# EAGLE design PowerMosfetGSVINRailV1 (EAGLE 9.6.2)
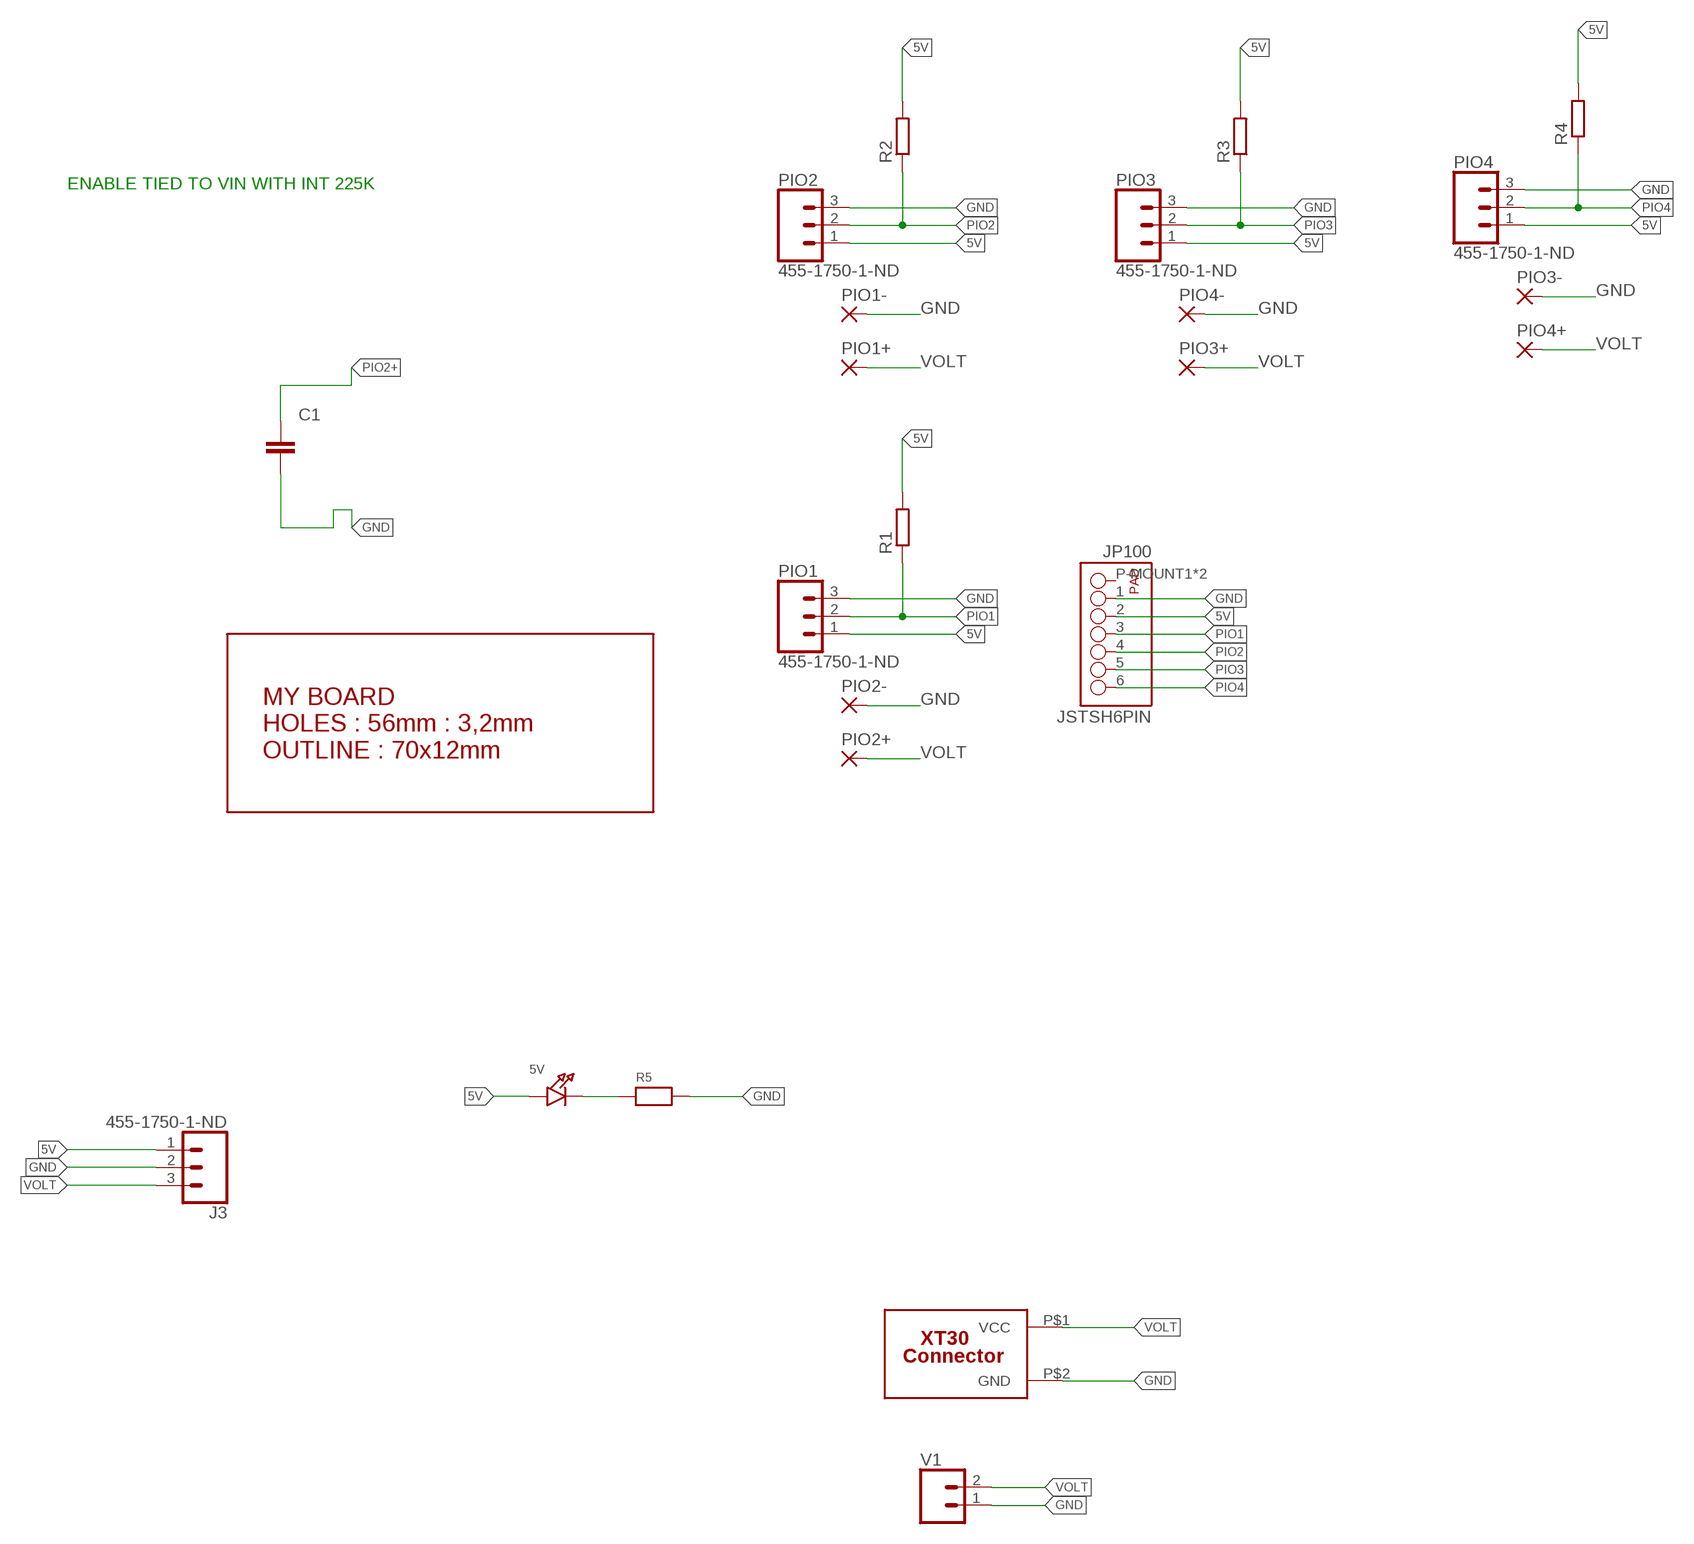
[diagram p0: schematic, sheet 1]

## Parts
5V  LED0805  [CHIPLED_0805]
C1  CAPACITOR_NPOL-0805  [C805]
J3  455-1750-1-ND  CONN_03  [1X03]
JP100  JSTSH6PIN  [SM06B-SRSS-TB]
PIO1  455-1750-1-ND  CONN_03  [1X03]
PIO1+  3,17/1,3  [3,17/1,3]
PIO1-  3,17/1,3  [3,17/1,3]
PIO2  455-1750-1-ND  CONN_03  [1X03]
PIO2+  3,17/1,3  [3,17/1,3]
PIO2-  3,17/1,3  [3,17/1,3]
PIO3  455-1750-1-ND  CONN_03  [1X03]
PIO3+  3,17/1,3  [3,17/1,3]
PIO3-  3,17/1,3  [3,17/1,3]
PIO4  455-1750-1-ND  CONN_03  [1X03]
PIO4+  3,17/1,3  [3,17/1,3]
PIO4-  3,17/1,3  [3,17/1,3]
R1  RESISTORR805-0805  [R805]
R2  RESISTORR805-0805  [R805]
R3  RESISTORR805-0805  [R805]
R4  RESISTORR805-0805  [R805]
R5  RESISTOR0805  [0805]
U$2  BOARD70X12HOES  [BOARD70X12]
U$6  XT30  [XT30-VERT]
V1  CONN_023.5MM  [SCREWTERMINAL-3.5MM-2]

## Nets
5V: 5V.A J3.1 JP100.2 PIO1.1 PIO2.1 PIO3.1 PIO4.1 R1.2 R2.2 R3.2 R4.2
GND: C1.2 J3.2 JP100.1 PIO1-.1(P) PIO1.3 PIO2-.1(P) PIO2.3 PIO3-.1(P) PIO3.3 PIO4-.1(P) PIO4.3 R5.2 U$6.P$2(GND) V1.1
N$3: 5V.C R5.1
PIO1: JP100.3 PIO1.2 R1.1
PIO2: JP100.4 PIO2.2 R2.1
PIO2+: C1.1
PIO3: JP100.5 PIO3.2 R3.1
PIO4: JP100.6 PIO4.2 R4.1
VOLT: J3.3 PIO1+.1(P) PIO2+.1(P) PIO3+.1(P) PIO4+.1(P) U$6.P$1(VCC) V1.2
Unconnected: JP100.P-MOUNT1 JP100.P-MOUNT2

## Notes on the sheet
- ENABLE TIED TO VIN WITH INT 225K

## Library data of the parts
5V = microbuilder:LED: LED 0603 - 0603 Surface Mount Package 2mA: Green LED - Low Power (3.9mcd, 2ma, 1.7Vf) - Digikey: 475-2709-2-ND Orange LED - Low Power (9.8mcd, 2ma, 1.8Vf) - Digikey: 475-1194-2-ND Red LED - Low Power (5mcd, 2ma, 1.8Vf) - Digikey: 475-1195-2-ND Yellow LED - Low Power (7mcd, 2ma, 1.8Vf) - Digikey: 475-1196-2-ND 5mA: Blue LED - Low Power (17mcd, 5ma, 2.9Vf) - Digikey: LNJ937W8CRACT-ND 0805 - 0805 Surface Mount Package 2mA: Red LED (8.8mcd, 2mA, 1.8Vf, Clear) - Low Power [Digikey: 475-2510-1-ND] Green LED (5mcd, 2mA, 1.8Vf, Clear) - Low Power [Digikey: 475-2730-1-ND] Yellow LED (11.3mcd, 2mA, 1.8Vf, Clear) - Low Power [Digikey: 475-2555-1-ND] 20mA: Red LED (104mcd, 20mA, Diffused) - LS R976 [Digikey: 475-1278-6-ND] Red LED (12mcd, 20mA, 2.0Vf, Clear) - APT2012EC [Digikey: 754-1128-1-ND] Green LED (15mcd, 20mA, 2.2Vf, Clear) - APT2012GC [Digikey: 754-1131-1-ND] Orange LED (160mcd, 20mA, 2.1Vf, Clear) - APT2012SECK [Digikey: 754-1130-1-ND] 1206 - 1206 Surface Mount Package Green LED (26mcd, 20mA, Diffused) - LG N971 [Digikey: 475-1407-6-ND] Red LED (15mcd, 20mA, Diffused) - LH N974 [Digikey: 475-1416-6-ND]
C1 = dp_devices:CAPACITOR_NPOL: Non-Polarized capacitor in various packages
J3 PIO1-PIO4 = SparkFun-Connectors:CONN_03: Multi connection point. Often used as Generic Header-pin footprint for 0.1 inch spaced/style header connections On any of the 0.1 inch spaced packages, you can populate with these: Break Away Headers - Straight <https://www.sparkfun.com/products/116> (PRT-00116) Break Away Male Headers - Right Angle <https://www.sparkfun.com/products/553> (PRT-00553) Female Headers <https://www.sparkfun.com/products/115> (PRT-00115) Break Away Headers - Machine Pin <https://www.sparkfun.com/products/117> (PRT-00117) Break Away Female Headers - Swiss Machine Pin <https://www.sparkfun.com/products/743> (PRT-00743) Stackable Header - 3 Pin (Female, 0.1") <https://www.sparkfun.com/products/13875> (PRT-13875) For SCREWTERMINALS and SPRING TERMINALS visit here: Screw Terimnals on SparkFun.com <https://www.sparkfun.com/search/results?term=Screw+Terminals> (5mm/3.5mm/2.54mm spacing) This device is also useful as a general connection point to wire up your design to another part of your project. Our various solder wires solder well into these plated through hole pads. Hook-Up Wire - Assortment (Stranded, 22 AWG) <https://www.sparkfun.com/products/11375> (PRT-11375) Hook-Up Wire - Assortment (Solid Core, 22 AWG) <https://www.sparkfun.com/products/11367> (PRT-11367) View the entire wire category on our website here <https://www.sparkfun.com/categories/141> Special notes: Molex polarized connector foot print use with SKU : PRT-08232 with associated crimp pins and housings.; PROD_ID: XXX-00000
JP100 = con-jst-shMax:JSTSH6PIN
PIO1+ PIO1- PIO2+ PIO2- PIO3+ PIO3- PIO4+ PIO4- = wirepad:3,17/1,3: THROUGH-HOLE PAD
R1-R4 = dp_devices:RESISTOR
R5 = microbuilder:RESISTOR: Resistors 0402 - 0402 Surface Mount Package 22 Ohm 1% 1/16W [Digikey: 311-22.0LRTR-ND] 33 Ohm 5% 1/16W 1.0K 5% 1/16W 1.5K 5% 1/16W 2.0K 1% 1/16W 10.0K 1% 1/16W [Digikey: 311-10.0KLRTR-ND] 10.0K 5% 1/16W [Digikey: RMCF0402JT10K0TR-ND] 12.1K 1% 1/16W [Digikey: 311-22.0LRTR-ND] 100.0K 5% 1/16W 0603 - 0603 Surface Mount Package 0 Ohm 1/10 Watt 1% Resistor 15 Ohm 1/10 Watt 1% Resistor 33 Ohm 1/10 Watt 1% Resistor 49.9 Ohm 1/10 Watt 1% Resistor 100 Ohm 1/10 Watt 1% Resistor 150 Ohm 1/10 Watt 1% Resistor 240 Ohm 1/10 Watt 1% Resistor 390 Ohm 1/10 Watt 1% Resistor 560 Ohm 1/10 Watt 1% Resistor 680 Ohm 1/10 Watt 1% Resistor 750 Ohm 1/10 Watt 1% Resistor 1.0K Ohm 1/10 Watt 1% Resistor 1.5K Ohm 1/10 Watt 1% Resistor 2.0K Ohm 1/10 Watt 1% Resistor 2.2K Ohm 1/10 Watt 1% Resistor 3.3K Ohm 1/10 Watt 1% Resistor 4.7K Ohm 1/10 Watt 1% Resistor 10.0K Ohm 1/10 Watt 1% Resistor 12.0K Ohm 1/10 Watt 1% Resistor 12.1K Ohm 1/10 Watt 1% Resistor 20.0K Ohm 1/10 Watt 1% Resistor 33.0K Ohm 1/10 Watt 1% Resistor 100.0K Ohm 1/10 Watt 1% Resistor 0805 - 0805 Surface Mount Package 0 Ohm 1/8 Watt 1% Resistor 33 Ohm 1/8 Watt 1% Resistor 100 Ohm 1/8 Watt 1% Resistor 150 Ohm 1/8 Watt 1% Resistor 200 Ohm 1/8 Watt 1% Resistor 240 Ohm 1/8 Watt 1% Resistor 330 Ohm 1/8 Watt 1% Resistor 390 Ohm 1/8 Watt 1% Resistor 470 Ohm 1/8 Watt 1% Resistor 1.0K Ohm 1/8 Watt 1% Resistor 1.5K Ohm 1/8 Watt 1% Resistor 2.0K Ohm 1/8 Watt 1% Resistor 4.7K Ohm 1/8 Watt 1% Resistor 5.1K Ohm 1/8 Watt 1% Resistor 5.6K Ohm 1/8 Watt 1% Resistor 10.0K Ohm 1/8 Watt 1% Resistor 22.0K Ohm 1/8 Watt 1% Resistor 33.0K Ohm 1/8 Watt 1% Resistor 100K Ohm 1/8 Watt 1% Resistor 1206 - 1206 Surface Mount Package 2012 - 2010 Surface Mount Package 0.11 Ohm 1/2 Watt 1% Resistor - Digikey: RHM.11UCT-ND
U$2 = MyBreadBoards:BOARD70X12HOES
U$6 = MyBreadBoards:XT30
V1 = SparkFun-Connectors:CONN_02: Multi connection point. Often used as Generic Header-pin footprint for 0.1 inch spaced/style header connections On any of the 0.1 inch spaced packages, you can populate with these: Break Away Headers - Straight <https://www.sparkfun.com/products/116> (PRT-00116) Break Away Male Headers - Right Angle <https://www.sparkfun.com/products/553> (PRT-00553) Female Headers <https://www.sparkfun.com/products/115> (PRT-00115) Break Away Headers - Machine Pin <https://www.sparkfun.com/products/117> (PRT-00117) Break Away Female Headers - Swiss Machine Pin <https://www.sparkfun.com/products/743> (PRT-00743) For SCREWTERMINALS and SPRING TERMINALS visit here: Screw Terimnals on SparkFun.com <https://www.sparkfun.com/search/results?term=Screw+Terminals> (5mm/3.5mm/2.54mm spacing) This device is also useful as a general connection point to wire up your design to another part of your project. Our various solder wires solder well into these plated through hole pads. Hook-Up Wire - Assortment (Stranded, 22 AWG) <https://www.sparkfun.com/products/11375> (PRT-11375) Hook-Up Wire - Assortment (Solid Core, 22 AWG) <https://www.sparkfun.com/products/11367> (PRT-11367) View the entire wire category on our website here <https://www.sparkfun.com/categories/141> Special notes: Molex polarized connector foot print use with: PRT-08233 with associated crimp pins and housings. 2.54_SCREWTERM for use with PRT-10571. 3.5mm Screw Terminal footprints for PRT-08084 5mm Screw Terminal footprints for use with PRT-08432; PROD_ID: CONN-08399

## Board
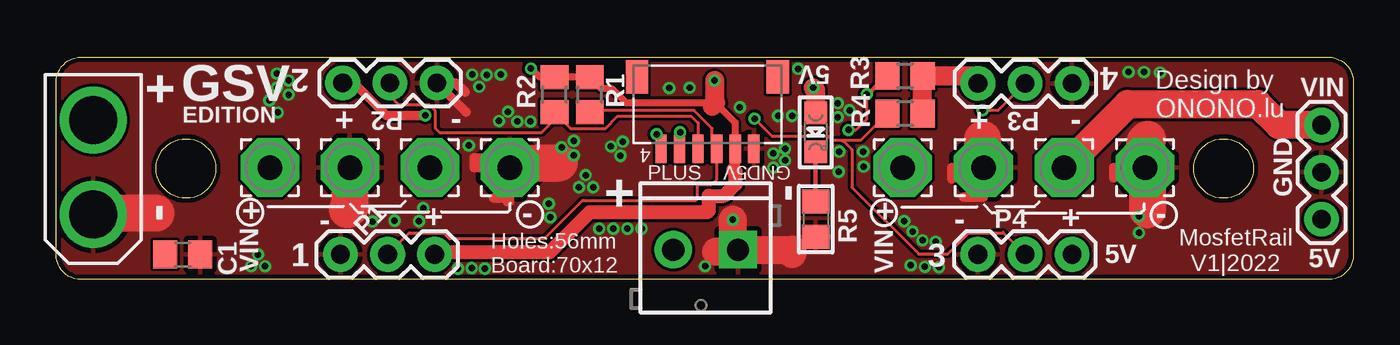
[diagram p1: board, top side]
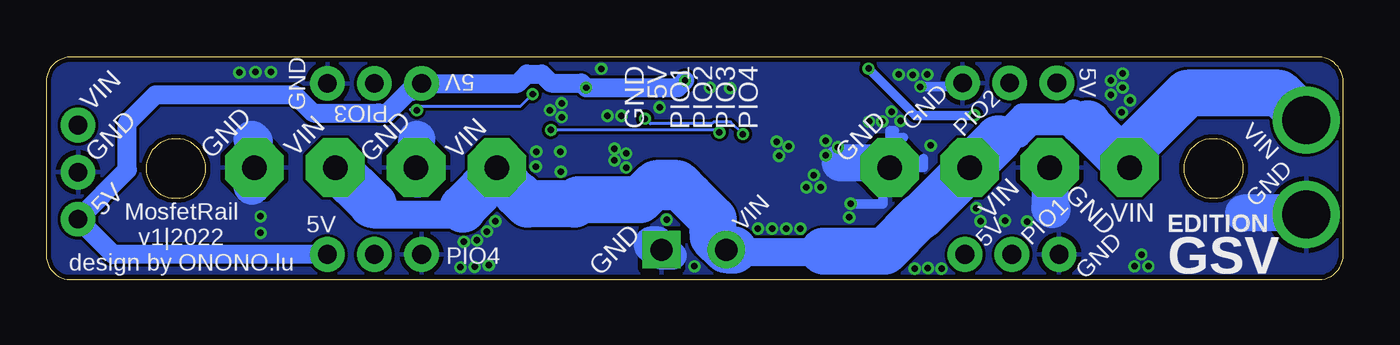
[diagram p2: board, bottom side, seen from below]

Size 70 x 12 mm. Coordinates in mm from the lower left corner, seen from the top.
Copper layers (1*16): Top 0.035mm / dielectric 1.5mm / Bottom 0.035mm
Design rules "dirt_cheap_dirty_boards.v1.1": minimum track width 6mil, minimum drill 12mil, track to track 6mil, track to pad 6mil, pad to pad 6mil, via to via 6mil, smd to smd 0mil, copper to edge 10mil, drill to drill 10mil, minimum pad ring 10mil, minimum via ring 6mil, stop-mask expansion 2mil, vias tented up to drill 25mil, thermal gap 10mil

### Footprints (pad centres in the part's own frame; a part is rotated, then mirrored left to right if it is on the bottom)
CHIPLED_0805 = smd 1.2 x 1.2: A 0,-1.05; C 0,1.05
C805 = smd 1.3 x 1.5: 1 -0.95,0; 2 0.95,0
1X03 = drill 1.016 pad 1.88: 1 0,0; 2 2.54,0; 3 5.08,0
SM06B-SRSS-TB = smd 0.6 x 1.55: 1 -7.58,4.445; 2 -6.58,4.445; 3 -5.58,4.445; 4 -4.58,4.445; 5 -3.58,4.445; 6 -2.58,4.445 | smd 1.2 x 1.8: P-MOUNT1 -8.88,0.57; P-MOUNT2 -1.28,0.57
3,17/1,3 = drill 1.321 pad 3.175 octagon: 1 0,0
R805 = smd 1.3 x 1.5: 1 -0.95,0; 2 0.95,0
0805 = smd 1.3 x 1.5: 1 -0.95,0; 2 0.95,0
XT30-VERT = drill 2.6: P$1 0.127,7.771; P$2 0.127,2.667
SCREWTERMINAL-3.5MM-2 = drill 1.2 pad 2.032 square: 1 0,0 | drill 1.2 pad 2.032: 2 3.5,0

### Placement (x,y rotation side)
5V  40.98,7.95 180 top
C1  6.82,1.35 0 top
J3  68.29,3.26 90 top
JP100  30.06,11.51 180 top
PIO1  20.41,1.35 180 top
PIO1+  11.52,6.05 90 top
PIO1-  15.84,6.05 90 top
PIO2  15.46,10.62 0 top
PIO2+  20.16,6.05 90 top
PIO2-  24.47,6.05 90 top
PIO3  49.75,10.6 0 top
PIO3+  45.68,6.05 90 top
PIO3-  50.04,6.05 90 top
PIO4  54.83,1.35 180 top
PIO4+  54.4,6.05 90 top
PIO4-  58.76,6.05 90 top
R1  28.79,9.99 90 top
R2  26.89,9.99 90 top
R3  45.81,11 0 top
R4  45.81,8.97 0 top
R5  40.98,3.26 270 top
U$2  69.94,-0.05 90 top
U$6  1.87,0.84 0 top
V1  36.79,1.6 180 top

### Tracks (layer width: path | path; a pad name or v marks a point on that pad's centre or on a via)
5V  (via drill 0.35)
  Top 0.152: 27.52,10.94 R2.2
  Top 0.381: JP100.2 36.64,8.49 35.78,9.35 35.4,9.35 | 27.52,10.94 R1.2 29.39,10.33 29.96,10.33 30.74,9.56 35.6,9.56 | R2.2 26.07,10.94 v25.62,11.39
  Top 0.508: 36.67,5.8 36.67,7.04 JP100.2 | v19.9,8.87 17.82,8.87 16.07,10.62 PIO2.1
  Top 0.762: 36.54,5.92 36.67,5.8 36.67,5.16 36.03,4.53 35.22,4.53 35.22,3.71 35.14,3.64 28.79,3.64 26.63,1.48 20.54,1.48 PIO1.1
  Top 1.016: R4.2 R3.2 49.34,11 PIO3.1 | v40.86,10.37 40.98,10.24 5V.A | v35.52,10.75 35.52,9.48 | 35.52,9.48 35.4,9.35 | 35.6,9.56 35.52,9.48
  Bottom 0.508: v25.62,11.39 23.09,8.87 v19.9,8.87 | 16.09,10.62 PIO2.1
  Bottom 1.016: PIO4.1 66.38,1.35 J3.1 65.62,5.92 65.62,8.46 64.1,9.99 56.58,9.99 55.59,9 52.08,9 | 52.03,8.97 52.06,9 52.08,9 | v35.52,10.75 35.9,10.37 v40.86,10.37 41.11,10.62 42.76,10.62 43.24,11.1 44.06,11.1 44.57,10.6 PIO3.1 50.15,10.19 50.41,10.19 51.6,9 52.08,9
GND  (via drill 0.35)
  Top 0.508: 22.12,9.04 PIO2.3 21.55,10.62 22.06,10.11 | PIO2-.1 22.54,6.05 22.54,6.56 23.79,6.56 | PIO2-.1 24.47,4.22 24.32,4.22 | PIO2-.1 24.47,4.4 23.59,4.4 | 48.96,4.45 50.04,4.45 PIO3-.1 48.35,6.05 48.35,5.44 | PIO4-.1 57.09,6.05 57.09,5.49
  Top 1.524: V1.1 39.71,1.6 39.71,1.38 | V1.1 36.79,1.5 35.63,1.5 | V1.1 36.51,1.6 v36.51,3.23
  Top 2: U$6.P$2 2.07,3.59 5.38,3.59 | PIO1-.1 15.84,3.89 15.71,3.76 | PIO2-.1 24.73,6.3 27.14,6.3 | PIO3-.1 50,6.09 50,7.57 | 58.89,3.76 58.89,5.92 PIO4-.1 58.76,7.44 58.89,7.56
  Bottom 0.508: PIO2.3 20.74,10.42 v22.82,10.42 | v26.58,4.09 24.83,4.09 24.83,5.59 | PIO2-.1 22.65,6.05 22.65,6.53 | PIO2-.1 24.47,8.06 24.22,8.06 | PIO2-.1 24.47,7.68 23.74,7.68
  Bottom 1.524: V1.1 36.79,1.3 36.18,1.3
  Bottom 2: U$6.P$2 2.07,3.59 5.38,3.59 | PIO1-.1 15.84,3.89 15.71,3.76 | PIO2-.1 24.73,6.3 27.14,6.3 | 50,7.57 50,6.09 PIO3-.1 50.04,5.54 49.93,5.42 | 58.89,7.57 58.76,7.45 PIO4-.1 58.89,5.92 58.89,5.03 | V1.1 37.07,1.88 37.3,1.88
  other vias: 30.06,2.75 29.3,2.75 30.82,2.75 31.59,2.75 28.21,4.98 28.97,4.98 28.56,5.64 30.44,6.68 29.94,7.19 30.57,7.45 35.02,0.72 38.7,6.05 38.7,6.81 39.33,6.43 39.33,7.07 38.95,8.84 39.71,8.84 33.09,10.34 34.18,10.37 22.42,0.61 21.68,0.59 12.54,9.99 12.54,10.75 11.5,9.68 11.9,10.37 11.95,9.02 11.9,11.13 10.5,0.72 11.27,0.72 10.89,1.35 22.44,11.08 23.23,11.05 27.93,7.5 27.93,6.71 27.27,7.14 42.23,5.82 43.55,6.91 42.25,6.91 42.18,8.77 42.18,9.53 42.81,9.15 47.46,2.04 46.12,0.77 46.88,0.69 47.64,0.66 57.88,11.21 58.71,11.21 59.58,11.18 23.89,8.56 24.88,8.54 24.37,9.07 25.59,8.54 23.99,11.08 43.58,6.1 45.76,3.15 58.43,2.52 58.43,3.41 46.22,2.59 46.75,2.11 23.13,0.59 22.27,7.24 18.25,3.18 19.57,3.15 17.06,3.13 19.8,3.86 36.9,9.3 40.05,11.38 26.66,3.36
  pour Top: -1.69,12.93 -1.69,-1.65 69.48,-1.65 70.86,-0.28 70.86,12.93
  pour Bottom: -1.69,12.93 -1.69,-1.8 69.52,-1.8 70.85,-0.46 70.85,12.93
N$3
  Top 0.254: R5.1 5V.C
PIO1
  Top 0.152: R1.1 28.89,9.14 34.43,9.14 35.4,8.16 35.4,7.31 JP100.3 35.65,5.41 35.37,5.14 34.61,5.14 34.61,4.37 34.51,4.27 28.41,4.27 26.35,2.21 21.2,2.21 20.89,2.52 19.04,2.52 PIO1.2
PIO2
  Top 0.152: JP100.4 34.63,8.46 34.27,8.82 30.3,8.82 29.64,8.16 27.77,8.16 R2.1 26.89,8.64 26.18,7.93 20.69,7.93 20.46,8.16 20.46,9.1 20.13,9.42 18.51,9.42 18,9.94 PIO2.2 18.1,10.62
PIO3  (via drill 0.35)
  Top 0.152: JP100.5 33.64,7.93 v33.67,7.95 | 44.7,10.97 v43.75,10.02 | v42.76,8.08 43.16,8.08 43.75,8.67 v43.75,10.02 | v43.75,10.02 44.73,11 | R3.1 43.87,10.02 v43.75,10.02 | v50,9.15 50.84,9.15 PIO3.2
  Bottom 0.152: v33.67,7.95 33.8,8.08 v42.76,8.08 | 43.65,10.11 v43.75,10.02 44.41,9.35 50.18,9.35 50.34,9.19 50.31,9.15 v50,9.15
PIO4  (via drill 0.35)
  Top 0.152: 42.38,7.53 41.89,7.53 41.68,7.73 38.64,7.73 v37.68,8.69 | 42.38,7.53 43.42,7.53 R4.1 | v32.4,7.85 32.66,7.59 32.64,7.57 JP100.6 | 42.38,7.53 42.44,7.47 42.48,7.47 42.94,7.01 42.94,4.98 46.55,1.38 48.12,1.38 48.58,1.83 49.26,2.52 51.07,2.52 51.09,2.54 PIO4.2
  Bottom 0.152: v32.4,7.85 33.06,8.51 33.97,8.51 34.08,8.41 37.4,8.41 v37.68,8.69
VOLT
  Top 1.499: J3.3 66,8.34 64.86,9.48
  Top 1.524: PIO4+.1 57.83,9.48 64.86,9.48
  Bottom 1.016: 12.1,6.35 12.1,6.66
  Bottom 1.27: 16.58,8.64 14.11,8.64 13.78,8.31 14.29,8.31 14.51,8.08 14.85,8.42 16.82,8.42 17.5,7.75 18.45,7.75 | 18.45,7.75 17.31,8.89 14.74,8.89 14.53,9.11 | 18.61,7.6 18.45,7.75
  Bottom 1.524: V1.2 33.17,1.48 24.86,1.48 20.28,6.05 PIO2+.1 | 34,2.31 34,2.49 | 44.9,5.26 44.16,4.53 35.27,4.53 | 47.51,3.79 47.79,3.51 52.24,3.51 52.42,3.7 52.42,4.07 | 11.52,6.96 PIO1+.1 11.83,6.35 12.1,6.35 | 45.33,5.69 PIO3+.1 45.68,5.73 44.02,4.07
  Bottom 2.54: U$6.P$1 3.44,10.06 8.42,10.06 11.52,6.96 | PIO1+.1 13.78,8.31 13.78,8.41 | 18.58,7.6 18.61,7.6 PIO2+.1 22.82,3.38 22.88,3.38 24.74,1.52 28.05,1.52 | 32.9,1.59 32.92,1.6 V1.2 34,2.31 | 34,2.49 34,3.26 35.27,4.53 35.93,5.19 37.09,5.19 37.97,4.3 41.28,4.3 41.5,4.07 44.02,4.07 44.6,4.65 | 45.33,5.69 45.33,5.38 45.05,5.1 | PIO4+.1 52.42,4.07 52.37,4.07 52.35,4.05 | 47.51,3.79 47.51,3.88 45.68,5.7 PIO3+.1

### Text on the board
tPlace: GSV | 2 | 4 | + | Design by / ONONO.lu | VIN | EDITION | + | P2 | - | + | P3 | - | 4 | PLUS | 5V | GND | + | - | GND | - | - | + | - | P4 | + | + | - | + | - | P1 | MosfetRail / V1|2022 | 1 | Holes:56mm / Board:70x12 | 3 | 5V | 5V | VIN | VIN
bPlace: PIO4 | PIO3 | PIO2 | PIO1 | 5V | GND | 5V | 5V | GND | VIN | PIO2 | GND | PIO3 | VIN | GND | VIN | GND | VIN | GND | GND | GND | VIN | GND | VIN | VIN | 5V | EDITION | PIO1 | 5V | 5V | GND | MosfetRail / v1|2022 / design by ONONO.lu | GSV | GND | PIO4